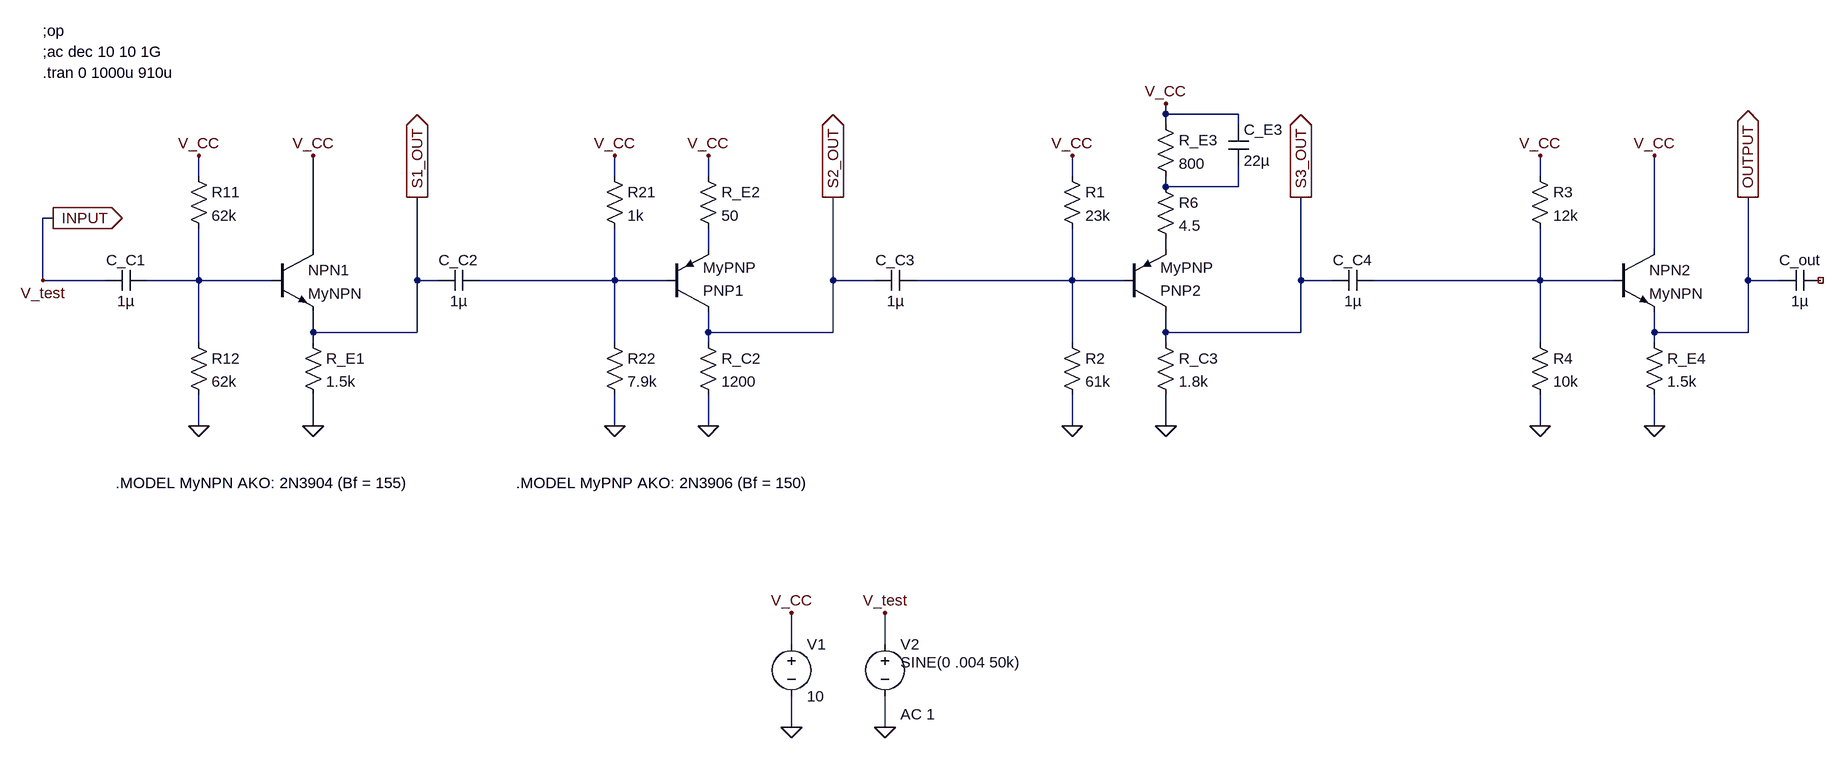
[diagram p0: schematic multistage.asc]
multistage.asc, the LTspice schematic file:
Version 4
SHEET 1 2836 1140
WIRE 1632 -64 1632 -80
WIRE 1744 -64 1632 -64
WIRE 1632 -48 1632 -64
WIRE 1744 -48 1744 -64
WIRE 144 32 144 0
WIRE 784 32 784 0
WIRE 928 32 928 0
WIRE 1488 32 1488 0
WIRE 2208 32 2208 0
WIRE 1632 48 1632 32
WIRE 1744 48 1744 16
WIRE 1744 48 1632 48
WIRE -80 96 -96 96
WIRE 320 144 320 0
WIRE 928 144 928 112
WIRE 1632 144 1632 128
WIRE 2384 144 2384 0
WIRE -96 192 -96 96
WIRE 0 192 -96 192
WIRE 144 192 144 112
WIRE 144 192 64 192
WIRE 256 192 144 192
WIRE 480 192 480 64
WIRE 512 192 480 192
WIRE 784 192 784 112
WIRE 784 192 576 192
WIRE 864 192 784 192
WIRE 1120 192 1120 64
WIRE 1184 192 1120 192
WIRE 1488 192 1488 112
WIRE 1488 192 1248 192
WIRE 1568 192 1488 192
WIRE 1840 192 1840 64
WIRE 1888 192 1840 192
WIRE 2208 192 2208 112
WIRE 2208 192 1952 192
WIRE 2320 192 2208 192
WIRE 2528 192 2528 64
WIRE 2576 192 2528 192
WIRE 320 272 320 240
WIRE 480 272 480 192
WIRE 480 272 320 272
WIRE 928 272 928 240
WIRE 1120 272 1120 192
WIRE 1120 272 928 272
WIRE 1632 272 1632 240
WIRE 1840 272 1840 192
WIRE 1840 272 1632 272
WIRE 2384 272 2384 240
WIRE 2528 272 2528 192
WIRE 2528 272 2384 272
WIRE 144 288 144 192
WIRE 320 288 320 272
WIRE 784 288 784 192
WIRE 928 288 928 272
WIRE 1488 288 1488 192
WIRE 1632 288 1632 272
WIRE 2208 288 2208 192
WIRE 2384 288 2384 272
WIRE 144 416 144 368
WIRE 320 416 320 368
WIRE 784 416 784 368
WIRE 928 416 928 368
WIRE 1488 416 1488 368
WIRE 1632 416 1632 368
WIRE 2208 416 2208 368
WIRE 2384 416 2384 368
WIRE 1056 752 1056 704
WIRE 1200 752 1200 704
WIRE 1056 880 1056 832
WIRE 1200 880 1200 832
FLAG 1056 880 0
FLAG 1200 880 0
FLAG 1056 704 V_CC
FLAG 320 416 0
FLAG 144 416 0
FLAG 320 0 V_CC
FLAG 1200 704 V_test
FLAG 144 0 V_CC
FLAG -80 96 INPUT
IOPIN -80 96 Out
FLAG 784 0 V_CC
FLAG 784 416 0
FLAG 928 416 0
FLAG 928 0 V_CC
FLAG 1488 0 V_CC
FLAG 1488 416 0
FLAG 1632 416 0
FLAG 1632 -80 V_CC
FLAG 2384 416 0
FLAG 2208 416 0
FLAG 2384 0 V_CC
FLAG 2208 0 V_CC
FLAG 2528 64 OUTPUT
IOPIN 2528 64 Out
FLAG 1840 64 S3_OUT
IOPIN 1840 64 Out
FLAG 1120 64 S2_OUT
IOPIN 1120 64 Out
FLAG 480 64 S1_OUT
IOPIN 480 64 Out
FLAG -96 192 V_test
DATAFLAG 832 192 ""
DATAFLAG 976 272 ""
DATAFLAG 928 112 ""
DATAFLAG 1632 272 ""
DATAFLAG 1488 192 ""
DATAFLAG 1632 128 ""
DATAFLAG 2384 272 ""
DATAFLAG 2272 192 ""
DATAFLAG 2384 80 ""
DATAFLAG 96 192 ""
DATAFLAG 144 144 ""
DATAFLAG 144 256 ""
SYMBOL npn 256 144 R0
SYMATTR InstName NPN1
SYMATTR Value MyNPN
SYMBOL voltage 1056 736 R0
WINDOW 123 0 0 Left 0
WINDOW 39 0 0 Left 0
SYMATTR InstName V1
SYMATTR Value 10
SYMBOL voltage 1200 736 R0
WINDOW 123 24 124 Left 2
WINDOW 39 0 0 Left 0
WINDOW 3 24 44 Left 2
SYMATTR Value2 AC 1
SYMATTR Value SINE(0 .004 50k)
SYMATTR InstName V2
SYMBOL res 128 16 R0
SYMATTR InstName R11
SYMATTR Value 62k
SYMBOL res 128 272 R0
SYMATTR InstName R12
SYMATTR Value 62k
SYMBOL res 304 272 R0
SYMATTR InstName R_E1
SYMATTR Value 1.5k
SYMBOL cap 64 176 R90
WINDOW 0 0 32 VBottom 2
WINDOW 3 32 32 VTop 2
SYMATTR InstName C_C1
SYMATTR Value 1µ
SYMBOL cap 576 176 R90
WINDOW 0 0 32 VBottom 2
WINDOW 3 32 32 VTop 2
SYMATTR InstName C_C2
SYMATTR Value 1µ
SYMBOL res 768 16 R0
SYMATTR InstName R21
SYMATTR Value 1k
SYMBOL res 768 272 R0
SYMATTR InstName R22
SYMATTR Value 7.9k
SYMBOL pnp 864 240 M180
SYMATTR InstName PNP1
SYMATTR Value MyPNP
SYMBOL res 912 16 R0
SYMATTR InstName R_E2
SYMATTR Value 50
SYMBOL res 912 272 R0
SYMATTR InstName R_C2
SYMATTR Value 1200
SYMBOL cap 1248 176 R90
WINDOW 0 0 32 VBottom 2
WINDOW 3 32 32 VTop 2
SYMATTR InstName C_C3
SYMATTR Value 1µ
SYMBOL res 1472 16 R0
SYMATTR InstName R1
SYMATTR Value 23k
SYMBOL res 1472 272 R0
SYMATTR InstName R2
SYMATTR Value 61k
SYMBOL pnp 1568 240 M180
SYMATTR InstName PNP2
SYMATTR Value MyPNP
SYMBOL res 1616 -64 R0
SYMATTR InstName R_E3
SYMATTR Value 800
SYMBOL res 1616 272 R0
SYMATTR InstName R_C3
SYMATTR Value 1.8k
SYMBOL cap 1728 -48 R0
SYMATTR InstName C_E3
SYMATTR Value 22µ
SYMBOL npn 2320 144 R0
SYMATTR InstName NPN2
SYMATTR Value MyNPN
SYMBOL res 2192 16 R0
SYMATTR InstName R3
SYMATTR Value 12k
SYMBOL res 2192 272 R0
SYMATTR InstName R4
SYMATTR Value 10k
SYMBOL res 2368 272 R0
SYMATTR InstName R_E4
SYMATTR Value 1.5k
SYMBOL cap 1952 176 R90
WINDOW 0 0 32 VBottom 2
WINDOW 3 32 32 VTop 2
SYMATTR InstName C_C4
SYMATTR Value 1µ
SYMBOL cap 2640 176 R90
WINDOW 0 0 32 VBottom 2
WINDOW 3 32 32 VTop 2
SYMATTR InstName C_out
SYMATTR Value 1µ
SYMBOL res 1616 32 R0
SYMATTR InstName R6
SYMATTR Value 4.5
TEXT -96 -160 Left 2 !;ac dec 10 10 1G
TEXT -96 -128 Left 2 !.tran 0 1000u 910u
TEXT 16 504 Left 2 !.MODEL MyNPN AKO: 2N3904 (Bf = 155)
TEXT 632 504 Left 2 !.MODEL MyPNP AKO: 2N3906 (Bf = 150)
TEXT -96 -192 Left 2 !;op

The netlist it stands for:
* multistage.asc
Q§NPN1 V_CC N004 S1_OUT 0 MyNPN
V1 V_CC 0 10
V2 INPUT 0 SINE(0 .004 50k) AC 1
R11 V_CC N004 62k
R12 N004 0 62k
R_E1 S1_OUT 0 1.5k
C_C1 N004 INPUT 1µ
C_C2 N005 S1_OUT 1µ
R21 V_CC N005 1k
R22 N005 0 7.9k
Q§PNP1 S2_OUT N005 N002 0 MyPNP
R_E2 V_CC N002 50
R_C2 S2_OUT 0 1200
C_C3 N006 S2_OUT 1µ
R1 V_CC N006 23k
R2 N006 0 61k
Q§PNP2 S3_OUT N006 N003 0 MyPNP
R_E3 V_CC N001 800
R_C3 S3_OUT 0 1.8k
C_E3 V_CC N001 22µ
Q§NPN2 V_CC N007 OUTPUT 0 MyNPN
R3 V_CC N007 12k
R4 N007 0 10k
R_E4 OUTPUT 0 1.5k
C_C4 N007 S3_OUT 1µ
C_out NC_01 OUTPUT 1µ
R6 N001 N003 4.5
.model NPN NPN
.model PNP PNP
.lib standard.bjt
;ac dec 10 10 1G
.tran 0 1000u 910u
.MODEL MyNPN AKO: 2N3904 (Bf = 155)
.MODEL MyPNP AKO: 2N3906 (Bf = 150)
;op
.backanno
.end